# EAGLE schematic robogram (EAGLE 6.3)
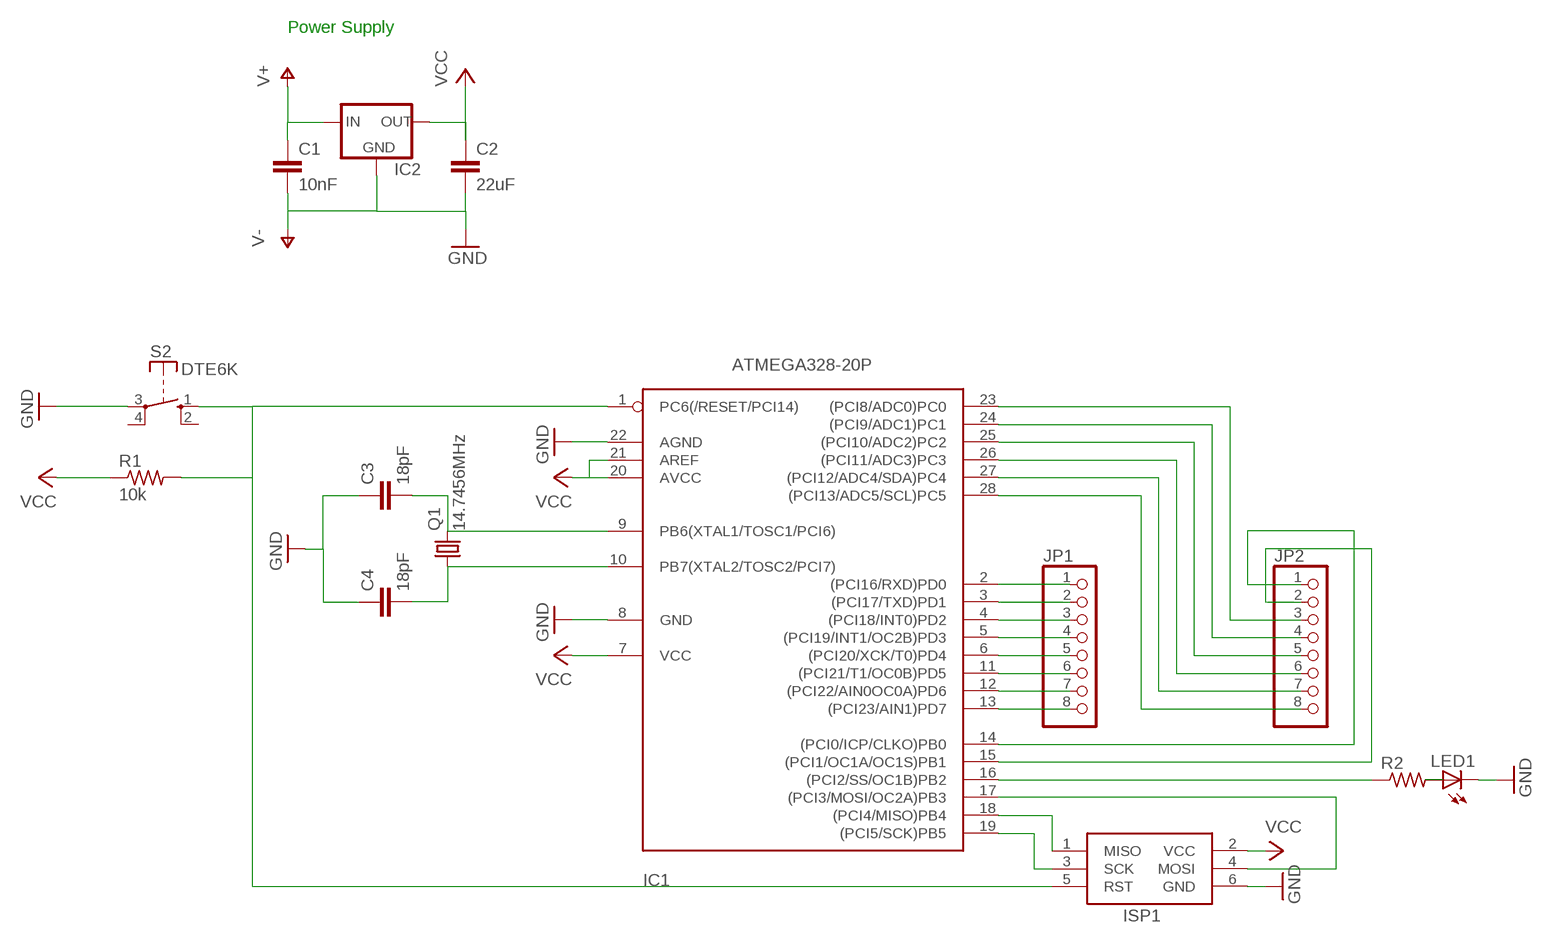
[diagram p0: schematic, sheet 1]

## Parts
C1  10nF  C5/5  [C5B5]
C2  22uF  C5/5  [C5B5]
C3  18pF  C5/5  [C5B5]
C4  18pF  C5/5  [C5B5]
IC1  ATMEGA328-20P  [DIL28-3]
IC2  78XXL  [78XXL]
ISP1  AVRISP-6  [AVRISP]
JP1  PINHD-1X8BIG  [1X08-BIG]
JP2  PINHD-1X8BIG  [1X08-BIG]
LED1  LED3MM  [LED3MM]
Q1  14.7456MHz  CRYSTALHC49U-V  [HC49U-V]
R1  10k  R-US_0204/5  [0204/5]
R2  R-US_0204/5  [0204/5]
S2  DTE6K  [DTE6K]

## Nets
GND: C3.1 C4.1 IC1.8(GND) IC1.22(AGND) ISP1.6(GND) LED1.K(C) S2.3(P)
N$1: C3.2 IC1.9(PB6(XTAL1/TOSC1/PCI6)) Q1.2
N$2: C4.2 IC1.10(PB7(XTAL2/TOSC2/PCI7)) Q1.1
N$3: IC1.1(PC6(/RESET/PCI14)) ISP1.5(RST) R1.2 S2.1(S)
N$4: IC1.17((PCI3/MOSI/OC2A)PB3) ISP1.4(MOSI)
N$5: IC1.18((PCI4/MISO)PB4) ISP1.1(MISO)
N$6: IC1.19((PCI5/SCK)PB5) ISP1.3(SCK)
N$7: IC1.2((PCI16/RXD)PD0) JP1.1
N$8: IC1.3((PCI17/TXD)PD1) JP1.2
N$9: IC1.4((PCI18/INT0)PD2) JP1.3
N$10: IC1.5((PCI19/INT1/OC2B)PD3) JP1.4
N$11: IC1.6((PCI20/XCK/T0)PD4) JP1.5
N$12: IC1.11((PCI21/T1/OC0B)PD5) JP1.6
N$13: IC1.12((PCI22/AIN0OC0A)PD6) JP1.7
N$14: IC1.13((PCI23/AIN1)PD7) JP1.8
N$15: IC1.16((PCI2/SS/OC1B)PB2) R2.1
N$16: LED1.A R2.2
N$17: IC1.15((PCI1/OC1A/OC1S)PB1) JP2.2
N$18: IC1.14((PCI0/ICP/CLKO)PB0) JP2.1
N$19: IC1.23((PCI8/ADC0)PC0) JP2.3
N$20: IC1.24((PCI9/ADC1)PC1) JP2.4
N$21: IC1.25((PCI10/ADC2)PC2) JP2.5
N$22: IC1.26((PCI11/ADC3)PC3) JP2.6
N$23: IC1.27((PCI12/ADC4/SDA)PC4) JP2.7
N$24: IC1.28((PCI13/ADC5/SCL)PC5) JP2.8
V+: C1.1 IC2.IN
V-: C1.2 C2.2 IC2.GND ; supply symbol labelled GND
VCC: C2.1 IC1.7(VCC) IC1.20(AVCC) IC1.21(AREF) IC2.OUT ISP1.2(VCC) R1.1
Unconnected: S2.2(S) S2.4(P)

## Notes on the sheet
- Power Supply

## Library data of the parts
C1-C4 = capacitor-wima:C: CAPACITOR naming: grid - package width
IC1 = robogram:ATMEGA328*P: MICROCONTROLLER 16 kBytes FLASH 1 kBytes SRAM 512 Bytes EEPROM USART 8-channel 10 bit ADC
IC2 = v-reg:78XXL: VOLTAGE REGULATOR
ISP1 = adafruit:AVRISP: AVR ISP HEADER Standard 6 pin header for AVR programming
JP1 JP2 = adafruit:PINHD-1X8: PIN HEADER
LED1 = adafruit:LED: LED OSRAM: - CHIPLED LG R971, LG N971, LY N971, LG Q971, LY Q971, LO R971, LY R971 LH N974, LH R974 LS Q976, LO Q976, LY Q976 LO Q996 - Hyper CHIPLED LW Q18S LB Q993, LB Q99A, LB R99A - SideLED LS A670, LO A670, LY A670, LG A670, LP A670 LB A673, LV A673, LT A673, LW A673 LH A674 LY A675 LS A676, LA A676, LO A676, LY A676, LW A676 LS A679, LY A679, LG A679 - Hyper Micro SIDELED® LS Y876, LA Y876, LO Y876, LY Y876 LT Y87S - SmartLED LW L88C, LW L88S LB L89C, LB L89S, LG L890 LS L89K, LO L89K, LY L89K LS L896, LA L896, LO L896, LY L896 - TOPLED LS T670, LO T670, LY T670, LG T670, LP T670 LSG T670, LSP T670, LSY T670, LOP T670, LYG T670 LG T671, LOG T671, LSG T671 LB T673, LV T673, LT T673, LW T673 LH T674 LS T676, LA T676, LO T676, LY T676, LB T676, LH T676, LSB T676, LW T676 LB T67C, LV T67C, LT T67C, LS T67K, LO T67K, LY T67K, LW E67C LS E67B, LA E67B, LO E67B, LY E67B, LB E67C, LV E67C, LT E67C LW T67C LS T679, LY T679, LG T679 LS T770, LO T770, LY T770, LG T770, LP T770 LB T773, LV T773, LT T773, LW T773 LH T774 LS E675, LA E675, LY E675, LS T675 LS T776, LA T776, LO T776, LY T776, LB T776 LHGB T686 LT T68C, LB T68C - Hyper Mini TOPLED® LB M676 - Mini TOPLED Santana® LG M470 LS M47K, LO M47K, LY M47K Source: http://www.osram.convergy.de/
Q1 = crystal:CRYSTAL: CRYSTAL; OC_FARNELL: 1666969; OC_NEWARK: unknown
R1 R2 = adafruit:R-US_: RESISTOR, American symbol
S2 = switch-misc:DT: ITT SWITCH